# EAGLE schematic NTAG I2C plus Class4 Antenna v1 (EAGLE 9.2.0)
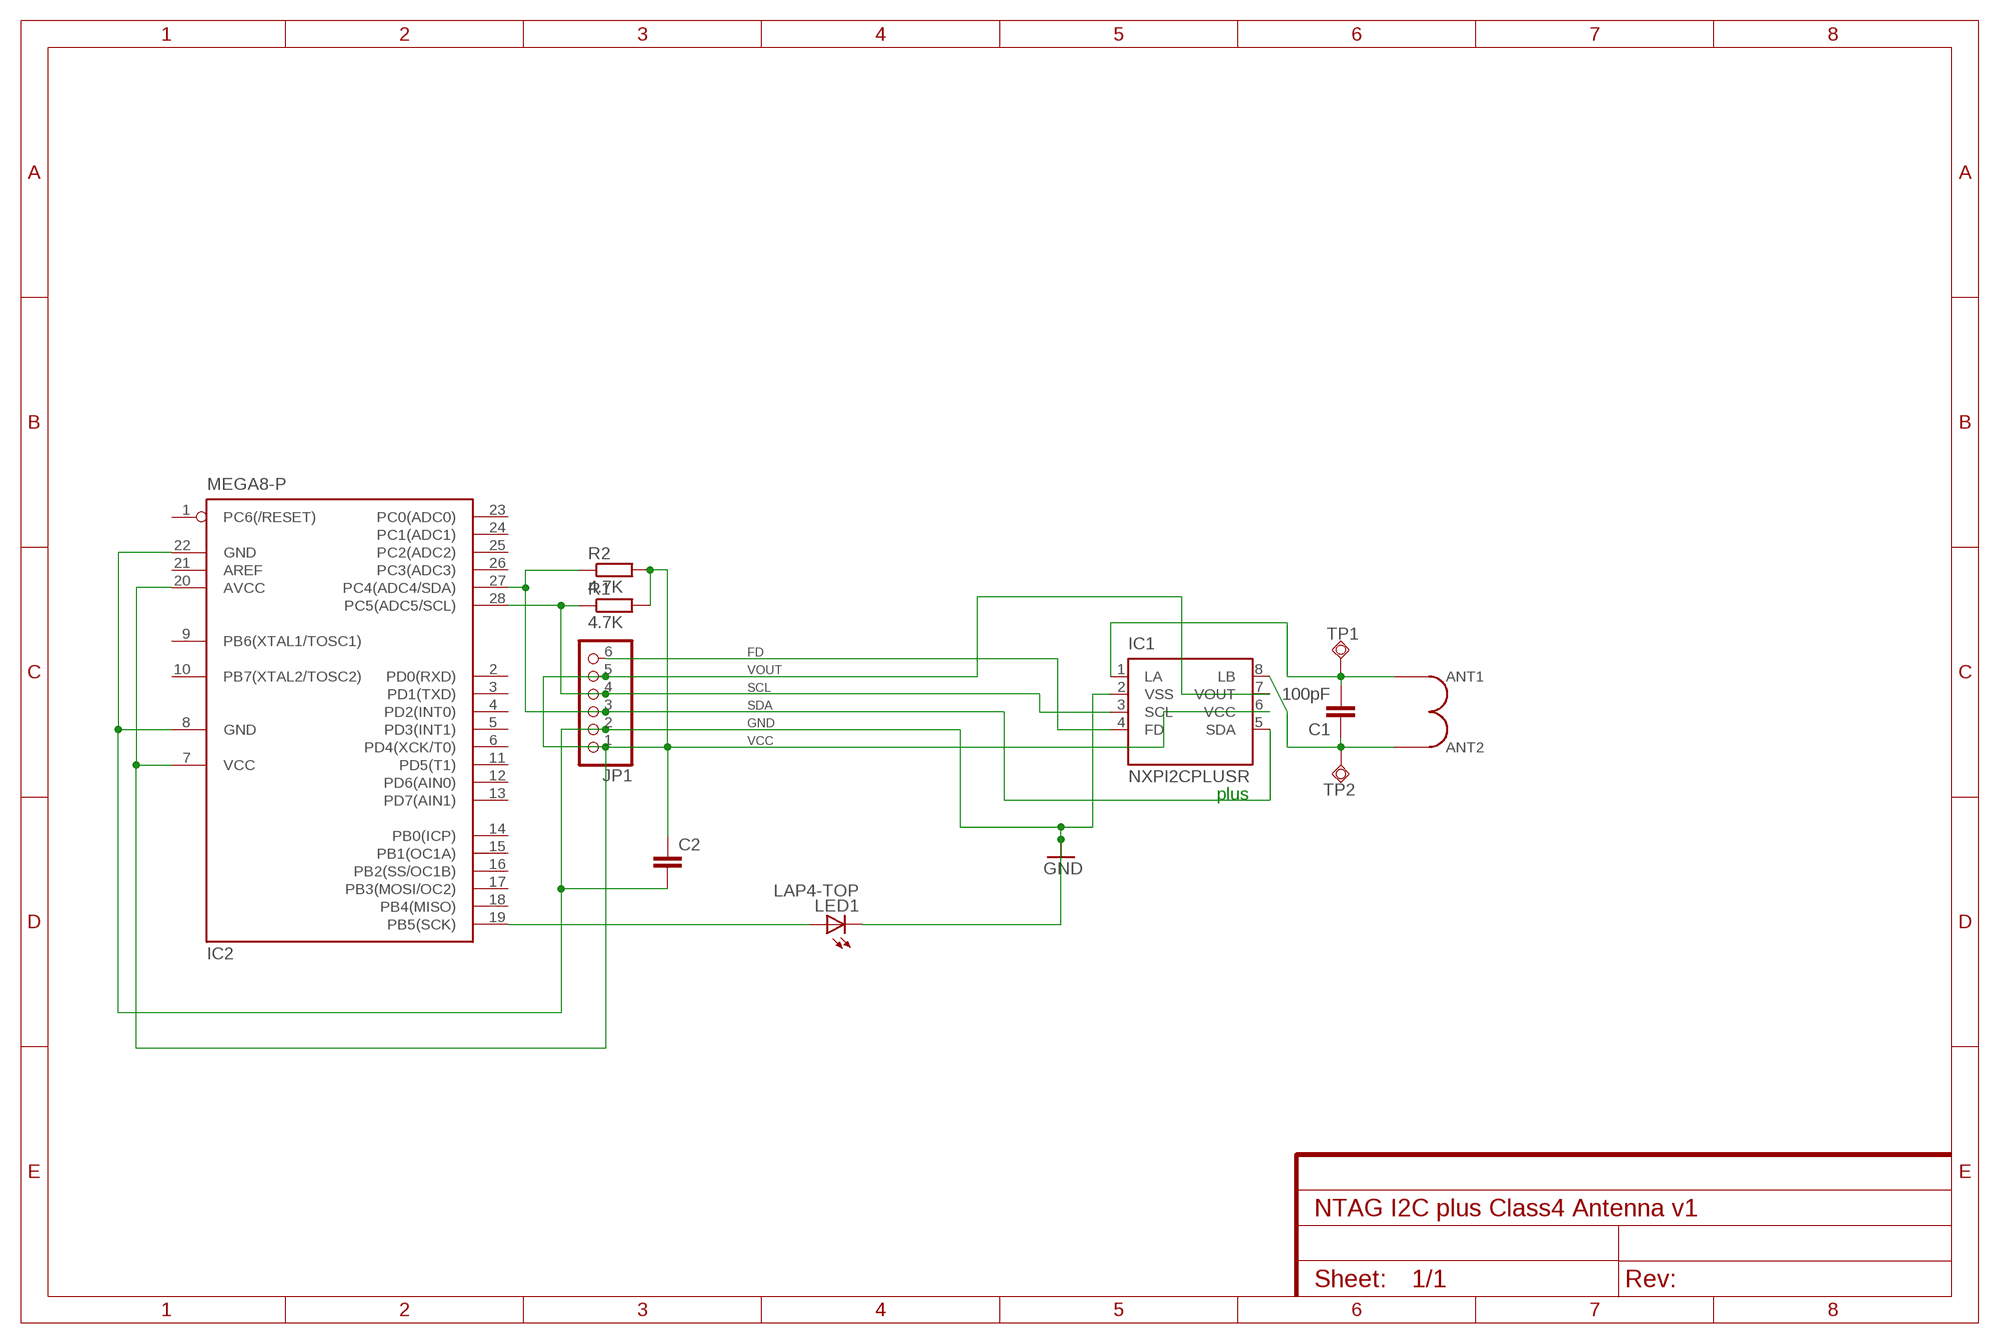
[diagram p0: schematic, sheet 1]

## Parts
C1  100pF  C-EUC0402K  [C0402K]
C2  C-EU025-030X050  [C025-030X050]
IC1  NXPI2CPLUSR  [SO8]
IC2  MEGA8-P  [DIL28-3]
JP1  PINHD-1X6/90  [1X06/90]
LED1  LAP4-TOP  [P47F-TOP]
R1  4.7K  R-EU_0204/7  [0204/7]
R2  4.7K  R-EU_0204/7  [0204/7]
TP1  TPSQPAD1-13  [P1-13]
TP2  TPSQPAD1-13  [P1-13]
U$1  ENERGY-HARVESTING_3-TURNS54X27_3TURN_THIN  [54X27_3TURNS_THIN]

## Nets
GND: C2.2 IC1.2(VSS) IC2.8(GND) IC2.22(GND) JP1.2 LED1.C
N$1: C1.2 IC1.1(LA) TP1.TP U$1.ANT1
N$2: C1.1 IC1.8(LB) TP2.TP U$1.ANT2
N$3: IC2.19(PB5(SCK)) LED1.A
N$4: IC1.3(SCL) IC2.28(PC5(ADC5/SCL)) JP1.4 R1.1
N$5: IC1.5(SDA) IC2.27(PC4(ADC4/SDA)) JP1.3 R2.1
N$6: C2.1 IC1.6(VCC) IC1.7(VOUT) IC2.7(VCC) IC2.20(AVCC) JP1.1 JP1.5 R1.2 R2.2
N$7: IC1.4(FD) JP1.6
Unconnected: IC2.1(PC6(/RESET)) IC2.2(PD0(RXD)) IC2.3(PD1(TXD)) IC2.4(PD2(INT0)) IC2.5(PD3(INT1)) IC2.6(PD4(XCK/T0)) IC2.9(PB6(XTAL1/TOSC1)) IC2.10(PB7(XTAL2/TOSC2)) IC2.11(PD5(T1)) IC2.12(PD6(AIN0)) IC2.13(PD7(AIN1)) IC2.14(PB0(ICP)) IC2.15(PB1(OC1A)) IC2.16(PB2(SS/OC1B)) IC2.17(PB3(MOSI/OC2)) IC2.18(PB4(MISO)) IC2.21(AREF) IC2.23(PC0(ADC0)) IC2.24(PC1(ADC1)) IC2.25(PC2(ADC2)) IC2.26(PC3(ADC3))

## Notes on the sheet
- FD
- VOUT
- SCL
- SDA
- GND
- VCC
- plus

## Library data of the parts
C1 = rcl:C-EU: CAPACITOR, European symbol
C2 = rcl:C-EU: CAPACITOR, European symbol; SPICEPREFIX: C
IC1 = bencustomlib:NXPI2CPLUS: High Precision Reference 2.5V/3.0V Source: http://www.analog.com/UploadedFiles/Data_Sheets/AD780.pdf; MPN: AD780BRZ-REEL; OC_FARNELL: 1464655; OC_NEWARK: 12M8938
IC2 = atmel:MEGA8-P: MICROCONTROLLER 8 Kbytes FLASH, 1 kbytes SRAM, 512 bytes EEPROM, USART, 4-channel 10 bit ADC, 2-channel 8 bit ADC Pin compatible with Atmega48, ATMega88, ATMega168 Source: avr.lbr; OC_FARNELL: unknown; OC_NEWARK: unknown
JP1 = pinhead (2):PINHD-1X6: PIN HEADER
LED1 = led:*P4: PointLED® Enhanced Thinfilm LED TOP & BOTTOM mount LS P47F, LR P47F, LA P47F, LY P47F, LT P4SG, LB P4SG, LW P4SG Source: http://catalog.osram-os.com .. LA_LR_LS_LY_P47F_Pb_free.pdf
R1 R2 = rcl:R-EU_: RESISTOR, European symbol; SPICEPREFIX: R
TP1 TP2 = testpad:TPSQ: Test pad
U$1 = NTAG_Antennas:ENERGY-HARVESTING_3-TURNS